# Altium schematic sheet Door Sensor Schematic.SchDoc: Door Sensor Schematic
size A4; Organization: Altium Limited; Address1: L3, 12a Rodborough Rd; Address2: Frenchs Forest; Address3: NSW; Address4: Australia 2086; DocumentNumber: 1; Revision: V1.0; SheetNumber: 1; SheetTotal: 1
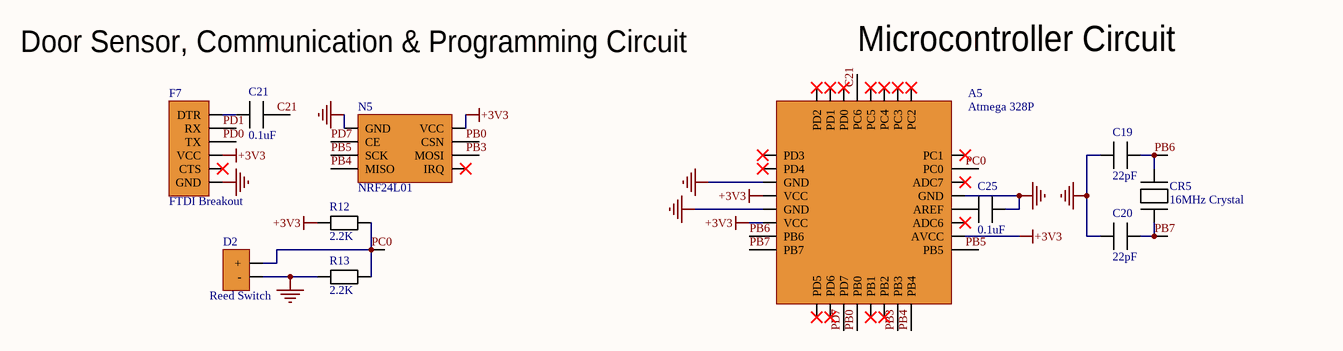
[diagram p0: Door Sensor Schematic.SchDoc]

## Parts
A5  Atmega 328P  [ATMega328P]
C19  22pF  [22pF Capacitor]
C20  22pF  [22pF Capacitor]
C21  0.1uF  [0.1uF Capacitor]
C25  0.1uF  [0.1uF Capacitor]
CR5  16MHz Crystal  [16MHz Crystal]
D2  Reed Switch  [Reed Switch]
F7  FTDI Breakout  [FTDI]
N5  NRF24L01  [NRF24L01]
R12  2.2K  [2.2K Resistor]
R13  2.2K  [2.2K Resistor]

## Nets
+3V3: A5.4(VCC) A5.6(VCC) A5.18(AVCC) F7.4(VCC) N5.5(VCC) R12.2
GND: A5.3(GND) A5.5(GND) A5.21(GND) C19.1 C20.1 C25.2 D2.1(-) F7.6(GND) N5.1(GND) R13.1
C21: A5.29(PC6) C21.2
PB0: A5.12(PB0) N5.6(CSN)
PB3: A5.15(PB3) N5.7(MOSI)
PB4: A5.16(PB4) N5.4(MISO)
PB5: A5.17(PB5) N5.3(SCK)
PB6: A5.7(PB6) C19.2 CR5.2
PB7: A5.8(PB7) C20.2 CR5.1
PC0: A5.23(PC0) D2.2(+) R12.1 R13.2
PD0: F7.3(TX)
PD1: F7.2(RX)
PD7: A5.11(PD7) N5.2(CE)
NetA5_20: A5.20(AREF) C25.1
NetC21_1: C21.1 F7.1(DTR)

Not connected (* = marked no-connect by the designer): A5 1(PD3)* 2(PD4)* 9(PD5)* 10(PD6)* 13(PB1)* 14(PB2)* 19(ADC6)* 22(ADC7)* 24(PC1)* 25(PC2)* 26(PC3)* 27(PC4)* 28(PC5)* 30(PD0)* 31(PD1)* 32(PD2)*; F7 5(CTS)*; N5 8(IRQ)*

## Notes on the sheet
- Door Sensor, Communication & Programming Circuit
- (near A5) Microcontroller Circuit
- Title
- Size:
- Date:
- A4
- Number:
- Time:
- Revision:
- Sheet
- of
- File:

## Library data of the parts
A5 = ATMEGA328PB-AUR: IC MCU 8BIT 32KB FLASH 32TQFP; Manufacturer: Microchip; Interface: I2C,SPI,UART,USART; Peripherals: Brown-out Detect/Reset,POR,PWM,WDT; Core Architecture: AVR; Frequency: 20MHz; Number of I/Os: 27; Oscillator Type: Internal; Supplier 1: Digi-Key; Manufacturer Part Number: ATMEGA328PB-AUR; RoHS: No; Category: Microcontrollers; Stock 1: 9971; Pricing 1: 1=1.42000, 25=1.30000, 100=1.18000 (USD); Case/Package: TQFP; Number of Pins: 32; Min Operating Temperature: -40°C; Max Operating Temperature: 85°C; Memory Type: FLASH; Packaging: Tape and Reel; Memory Size: 32KB; ComponentLink1URL: http://www.microchip.com/mymicrochip/filehandler.aspx?ddocname=en589666&src-supplier=Digi-Key; ComponentLink1Description: http://www.microchip.com/mymicrochip/filehandler.aspx?ddocname=en589666&src-supplier=Digi-Key; Supplier Part Number 1: ATMEGA328PB-AURCT-ND
C19 C20 = 06035A220JAT2A: Cap Ceramic 22pF 50V C0G 5% SMD 0603 125C Paper T/R; Manufacturer: Kyocera AVX; Insulation Resistance: 100GR; Temperature Coefficient: 30ppm/°C; Supplier 1: Digi-Key; Manufacturer Part Number: 06035A220JAT2A; RoHS: Yes; Category: Ceramic Capacitors; Stock 1: 678111; Pricing 1: 1=0.10000, 10=0.05600, 50=0.03040, 100=0.02480, 500=0.01772, 1000=0.01392 (USD); Mount: Surface Mount,PCB; Case/Package: 0603; Number of Pins: 2; Case Code (Imperial): 0603; Case Code (Metric): 1608; Contact Plating: Tin,Matte; Dielectric Material: Ceramic; Min Operating Temperature: -55°C; Max Operating Temperature: 125°C; Tolerance: 5%; Capacitance: 22pF; Voltage Rating (DC): 50V; Packaging: Tape and Reel; Dielectric: C0G; Voltage: 50V; Voltage Rating: 50V; Package Quantity: 1; Termination: SMD/SMT; Length: 1.6mm; Width: 0.81mm; Height: 0.63mm; Thickness: 0.035inch; Depth: 0.81mm; Radiation Hardening: No; REACH SVHC: No SVHC; Lead Free: Lead Free; ComponentLink1URL: https://datasheet.ciiva.com/11788/0900766b802d4697-11788031.pdf?src-supplier=RSComponents; ComponentLink1Description: https://datasheet.ciiva.com/11788/0900766b802d4697-11788031.pdf?src-supplier=RSComponents; ComponentLink2URL: https://datasheet.ciiva.com/16351/ccog-16351125.pdf?src-supplier=Future+Electronics; ComponentLink2Description: https://datasheet.ciiva.com/16351/ccog-16351125.pdf?src-supplier=Future+Electronics; ComponentLink3URL: https://datasheet.ciiva.com/1124/759117-1124728.pdf?src-supplier=Element14; ComponentLink3Description: https://datasheet.ciiva.com/1124/759117-1124728.pdf?src-supplier=Element14; ComponentLink4URL: https://datasheet.ciiva.com/7855/759117-7855064.pdf?src-supplier=Element14; ComponentLink4Description: https://datasheet.ciiva.com/7855/759117-7855064.pdf?src-supplier=Element14; ComponentLink5URL: https://datasheet.ciiva.com/150/ccog-150366.pdf?src-supplier=Digi-Key; ComponentLink5Description: https://datasheet.ciiva.com/150/ccog-150366.pdf?src-supplier=Digi-Key; ComponentLink6URL: https://datasheet.ciiva.com/150/ccog-150367.pdf?src-supplier=Digi-Key; ComponentLink6Description: https://datasheet.ciiva.com/150/ccog-150367.pdf?src-supplier=Digi-Key; Supplier Part Number 1: 478-1167-1-ND
C21 C25 = 06033C104KAT4A: CAP CER 0.1UF 25V X7R 0603; Manufacturer: Kyocera AVX; Capacitance: 100nF; Tolerance: 10%; Supplier 1: Digi-Key; Manufacturer Part Number: 06033C104KAT4A; RoHS: Yes; Category: Ceramic Capacitors; Stock 1: 6112957; Pricing 1: 1=0.10000, 10=0.04200, 50=0.02320, 100=0.01890, 500=0.01348, 1000=0.01059, 2500=0.00962, 5000=0.00886 (USD); Mount: Surface Mount; Case/Package: 0603; Number of Pins: 2; Case Code (Metric): 1608; Case Code (Imperial): 0603; Min Operating Temperature: -55°C; Max Operating Temperature: 125°C; Packaging: Tape and Reel; Voltage Rating (DC): 25V; Dielectric: X7R; Package Quantity: 1; Voltage Rating: 25V; Termination: SMD/SMT; Length: 1.6mm; Width: 0.032inch; Height: 0.9mm; Thickness: 0.035inch; Depth: 0.81mm; REACH SVHC: No SVHC; Lead Free: Lead Free; ComponentLink1URL: https://datasheet.ciiva.com/22619/1679506-22619862.pdf?src-supplier=Element14; ComponentLink1Description: https://datasheet.ciiva.com/22619/1679506-22619862.pdf?src-supplier=Element14; ComponentLink2URL: https://datasheet.ciiva.com/28613/1679506-28613035.pdf?src-supplier=Element14; ComponentLink2Description: https://datasheet.ciiva.com/28613/1679506-28613035.pdf?src-supplier=Element14; ComponentLink3URL: https://datasheet.ciiva.com/6277/cx7r-6277758.pdf?src-supplier=Digi-Key; ComponentLink3Description: https://datasheet.ciiva.com/6277/cx7r-6277758.pdf?src-supplier=Digi-Key; ComponentLink4URL: https://datasheet.ciiva.com/6277/cx7r-6277759.pdf?src-supplier=Digi-Key; ComponentLink4Description: https://datasheet.ciiva.com/6277/cx7r-6277759.pdf?src-supplier=Digi-Key; Supplier Part Number 1: 478-7018-1-ND
CR5 = ECS-160-20-3X-TR: CRYSTAL 16.0000MHZ 20PF SMD; Manufacturer: ECS International; Frequency Tolerance: 30ppm; ESR (Equivalent Series Resistance): 50R; Frequency Stability: 50ppm; Supplier 1: Digi-Key; Manufacturer Part Number: ECS-160-20-3X-TR; RoHS: Yes; Category: Crystals; Stock 1: 6685; Pricing 1: 1=0.35000, 10=0.28800, 50=0.25880, 100=0.23000, 500=0.21850, 1000=0.18400 (USD); Mount: Surface Mount; Min Operating Temperature: -10°C; Max Operating Temperature: 70°C; Package Quantity: 1; Frequency: 16MHz; Load Capacitance: 20pF; Packaging: Tape and Reel; Tolerance: 30ppm; Termination: SMD/SMT; Length: 0.276inch; Width: 0.161inch; Height: 0.091inch; Lead Free: Lead Free; ComponentLink1URL: https://datasheet.ciiva.com/852/csm-3x-852328.pdf?src-supplier=Digi-Key; ComponentLink1Description: https://datasheet.ciiva.com/852/csm-3x-852328.pdf?src-supplier=Digi-Key; ComponentLink2URL: https://datasheet.ciiva.com/852/csm-3x-852329.pdf?src-supplier=Digi-Key; ComponentLink2Description: https://datasheet.ciiva.com/852/csm-3x-852329.pdf?src-supplier=Digi-Key; ComponentLink3URL: https://datasheet.ciiva.com/852/csm-3x-852330.pdf?src-supplier=Digi-Key; ComponentLink3Description: https://datasheet.ciiva.com/852/csm-3x-852330.pdf?src-supplier=Digi-Key; Supplier Part Number 1: XC1776CT-ND
D2 = COM-13247: Magnetic Door Switch Set; Manufacturer: SparkFun; Actuator Material: Magnet; Supplier 1: Digi-Key; Manufacturer Part Number: COM-13247; RoHS: No; Stock 1: 112; Pricing 1: 1=3.50000 (USD); Termination: Wire Leads; Type: Reed Switch; ComponentLink1URL: https://media.digikey.com/pdf/Data%20Sheets/Sparkfun%20PDFs/COM-13247_Web.pdf?src-supplier=Digi-Key; ComponentLink1Description: https://media.digikey.com/pdf/Data%20Sheets/Sparkfun%20PDFs/COM-13247_Web.pdf?src-supplier=Digi-Key; Supplier Part Number 1: 1568-1607-ND
F7 = FTDI: FTDI USB to TTL serial converter module
N5 = NRF24L01: 3.3V NRF24L01 WIRELESS RF MODULE
R12 R13 = RMCF0603JT2K20: RES TF 1/10W 2.2K OHM 5% 0603; Manufacturer: Stackpole Electronics; Max Power Dissipation: 100mW; Temperature Coefficient: 100ppm/°C; Resistance: 2.2kR; Supplier 1: Digi-Key; Manufacturer Part Number: RMCF0603JT2K20; RoHS: Yes; Category: Chip SMD Resistors; Stock 1: 236677; Pricing 1: 1=0.10000, 10=0.01300, 100=0.00530, 1000=0.00239, 2500=0.00207 (USD); Mount: Surface Mount; Case/Package: 0603; Case Code (Imperial): 0603; Case Code (Metric): 1608; Contact Plating: Tin,Matte; Min Operating Temperature: -55°C; Max Operating Temperature: 155°C; Resistor Type: Thick Film; Number of Terminations: 2; Packaging: Tape and Reel; Features: Automotive AEC-Q200; Tolerance: 5%; Power Rating: 100mW; Length: 1.55mm; Width: 0.031inch; Height: 0.022inch; Depth: 0.8mm; Radiation Hardening: No; Military Standard: Not; Lead Free: Lead Free; ComponentLink1URL: https://datasheet.ciiva.com/3882/40960751s7172021n1174-3882844.pdf?src-supplier=Arrow+Electronics; ComponentLink1Description: https://datasheet.ciiva.com/3882/40960751s7172021n1174-3882844.pdf?src-supplier=Arrow+Electronics; ComponentLink2URL: https://datasheet.ciiva.com/26919/getdatasheetpartid-360915-26919531.pdf?src-supplier=Verical; ComponentLink2Description: https://datasheet.ciiva.com/26919/getdatasheetpartid-360915-26919531.pdf?src-supplier=Verical; Supplier Part Number 1: RMCF0603JT2K20CT-ND